# Altium schematic sheet Dual-MCU-control-board.SchDoc
size A1; SheetNumber: 1; SheetTotal: 1
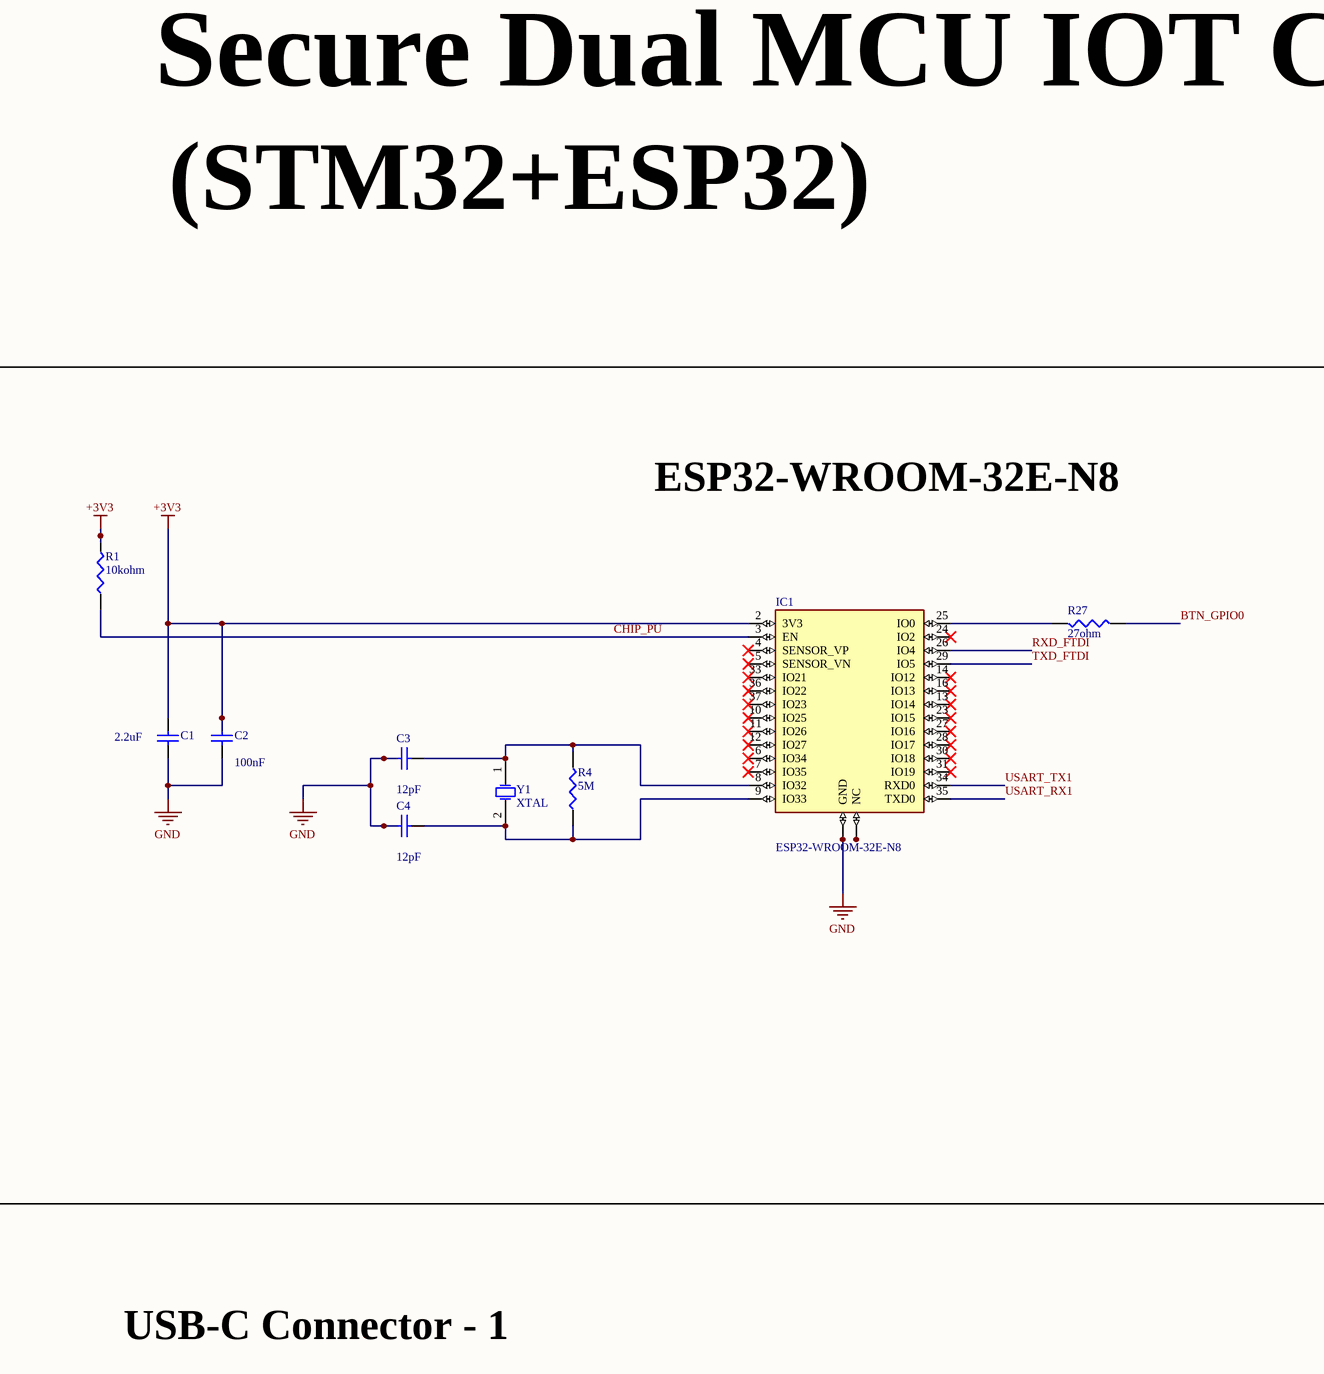
[diagram p0: Dual-MCU-control-board.SchDoc, top left]
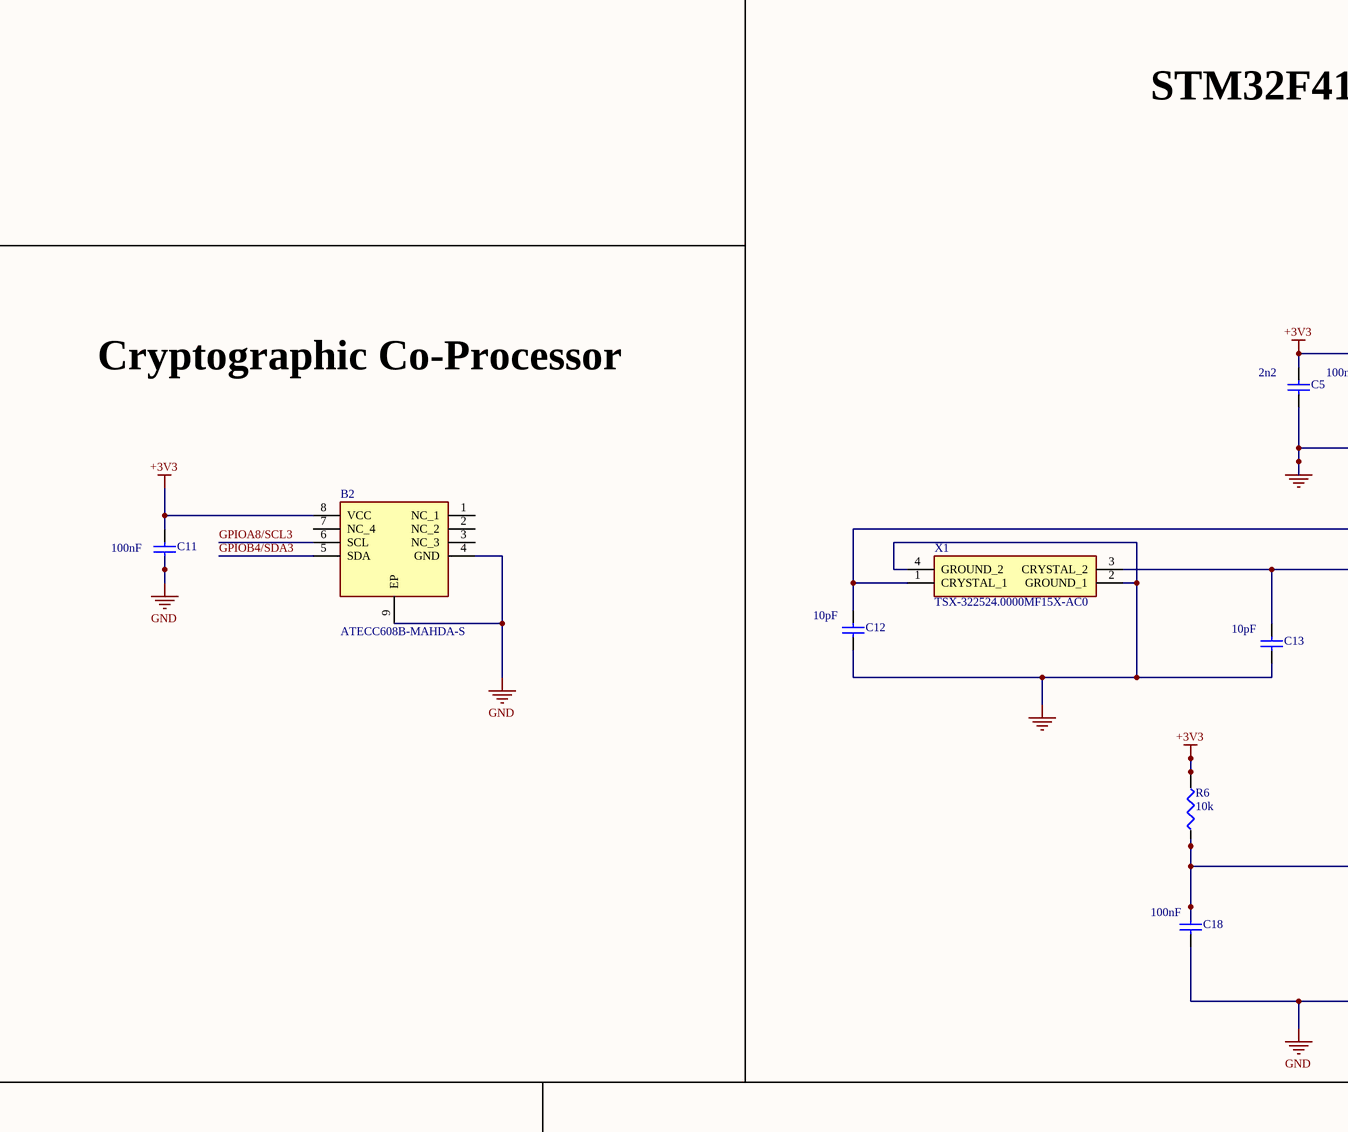
[diagram p1: Dual-MCU-control-board.SchDoc, top middle]
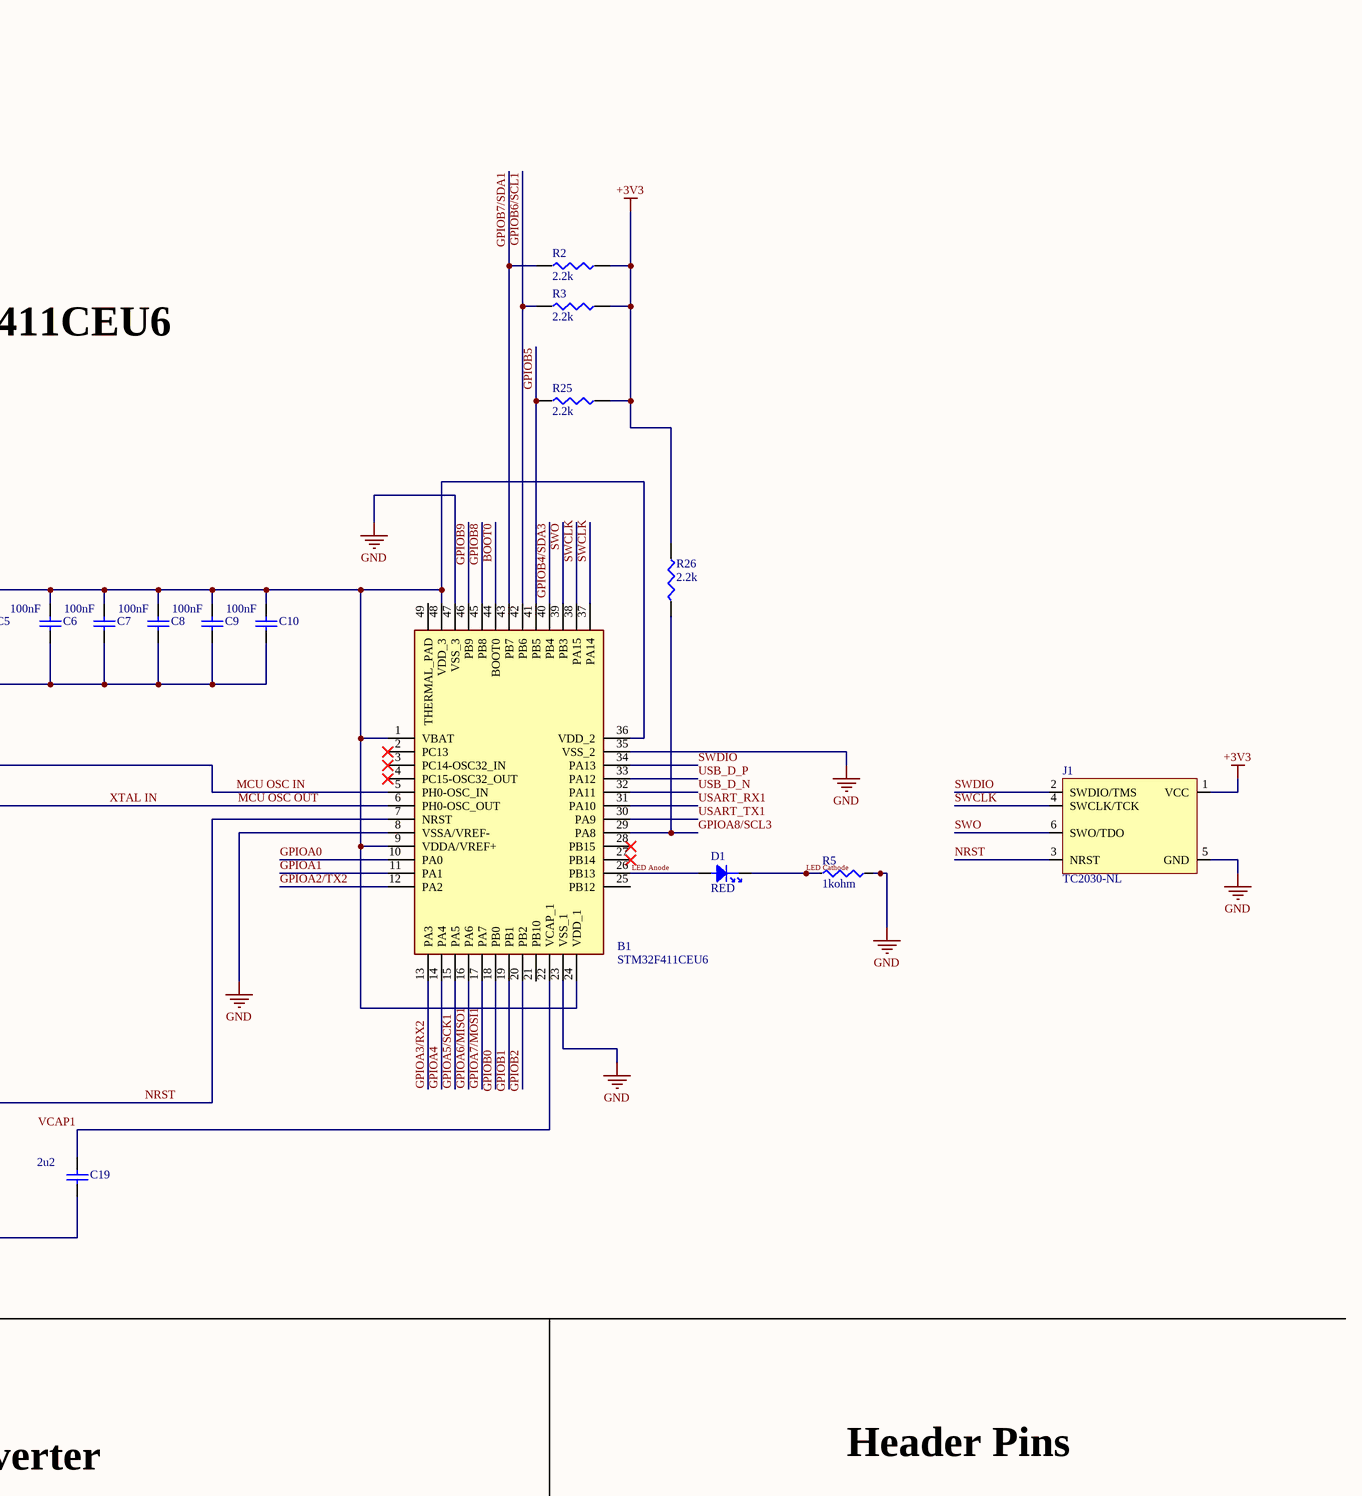
[diagram p2: Dual-MCU-control-board.SchDoc, top right]
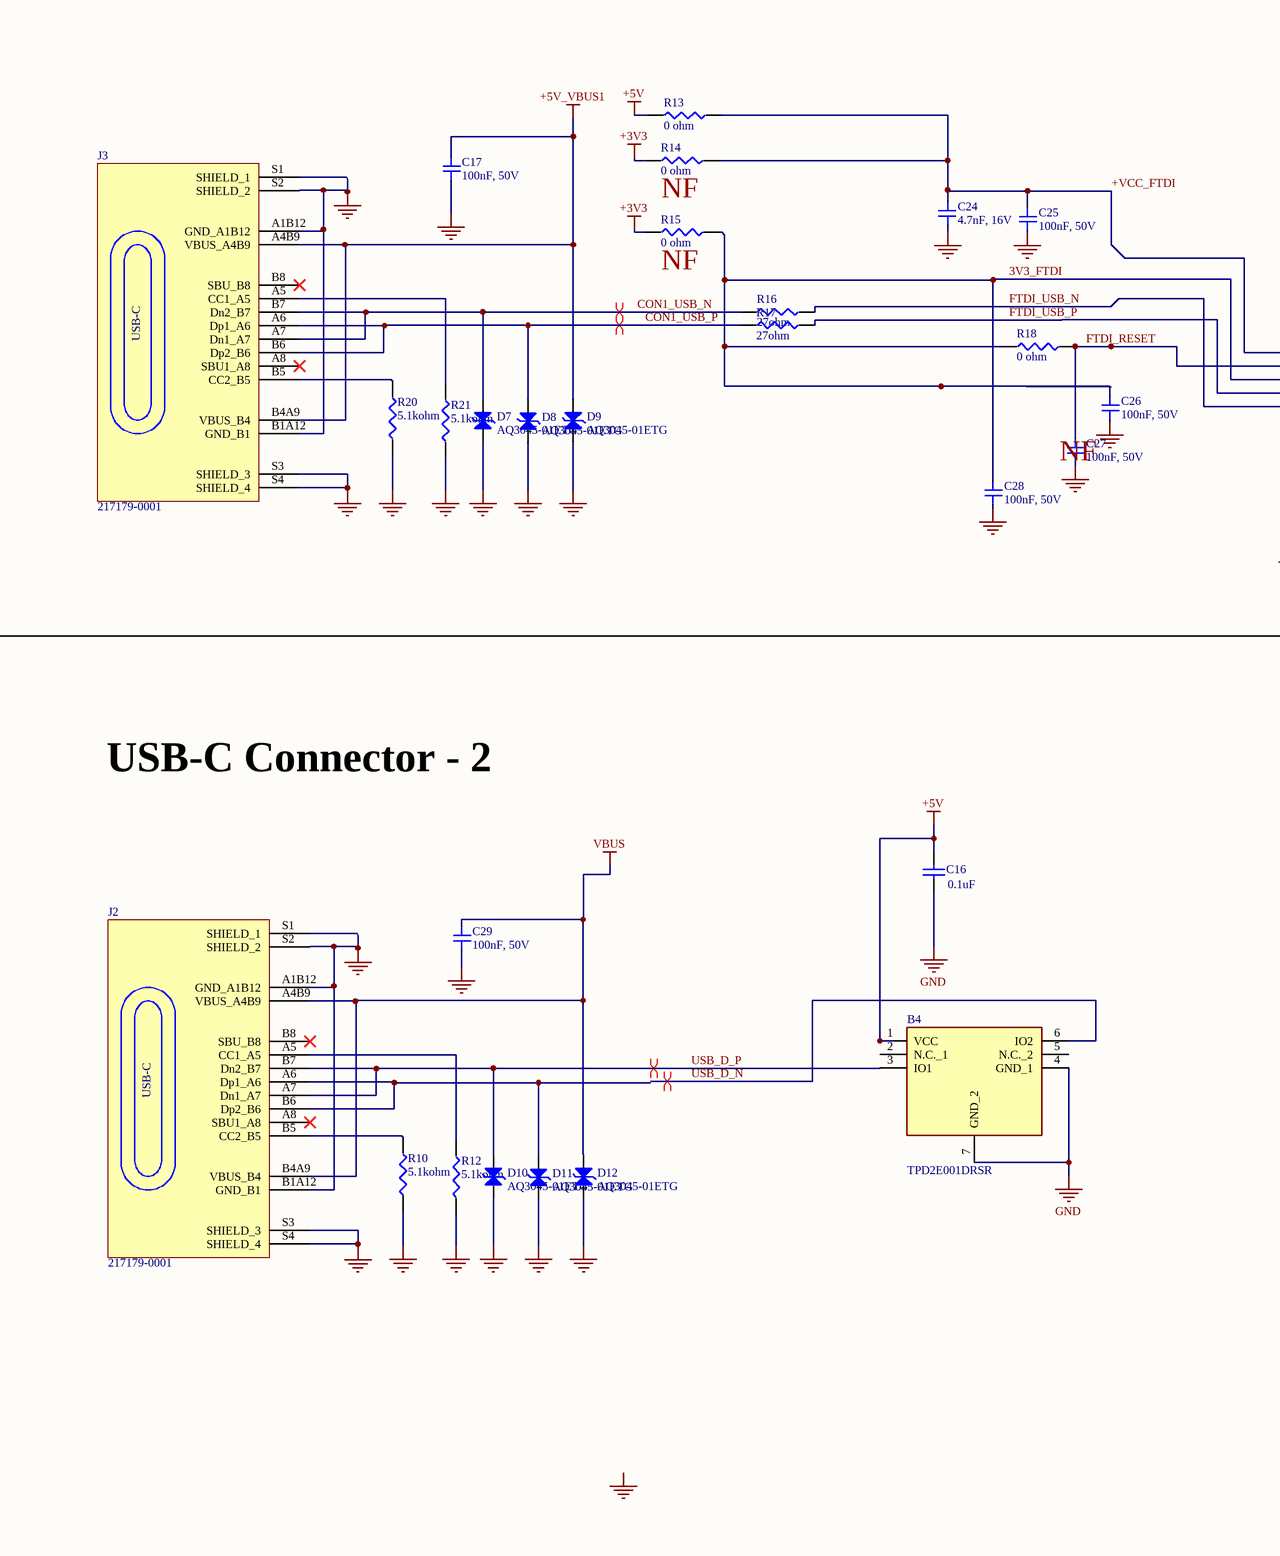
[diagram p3: Dual-MCU-control-board.SchDoc, bottom left]
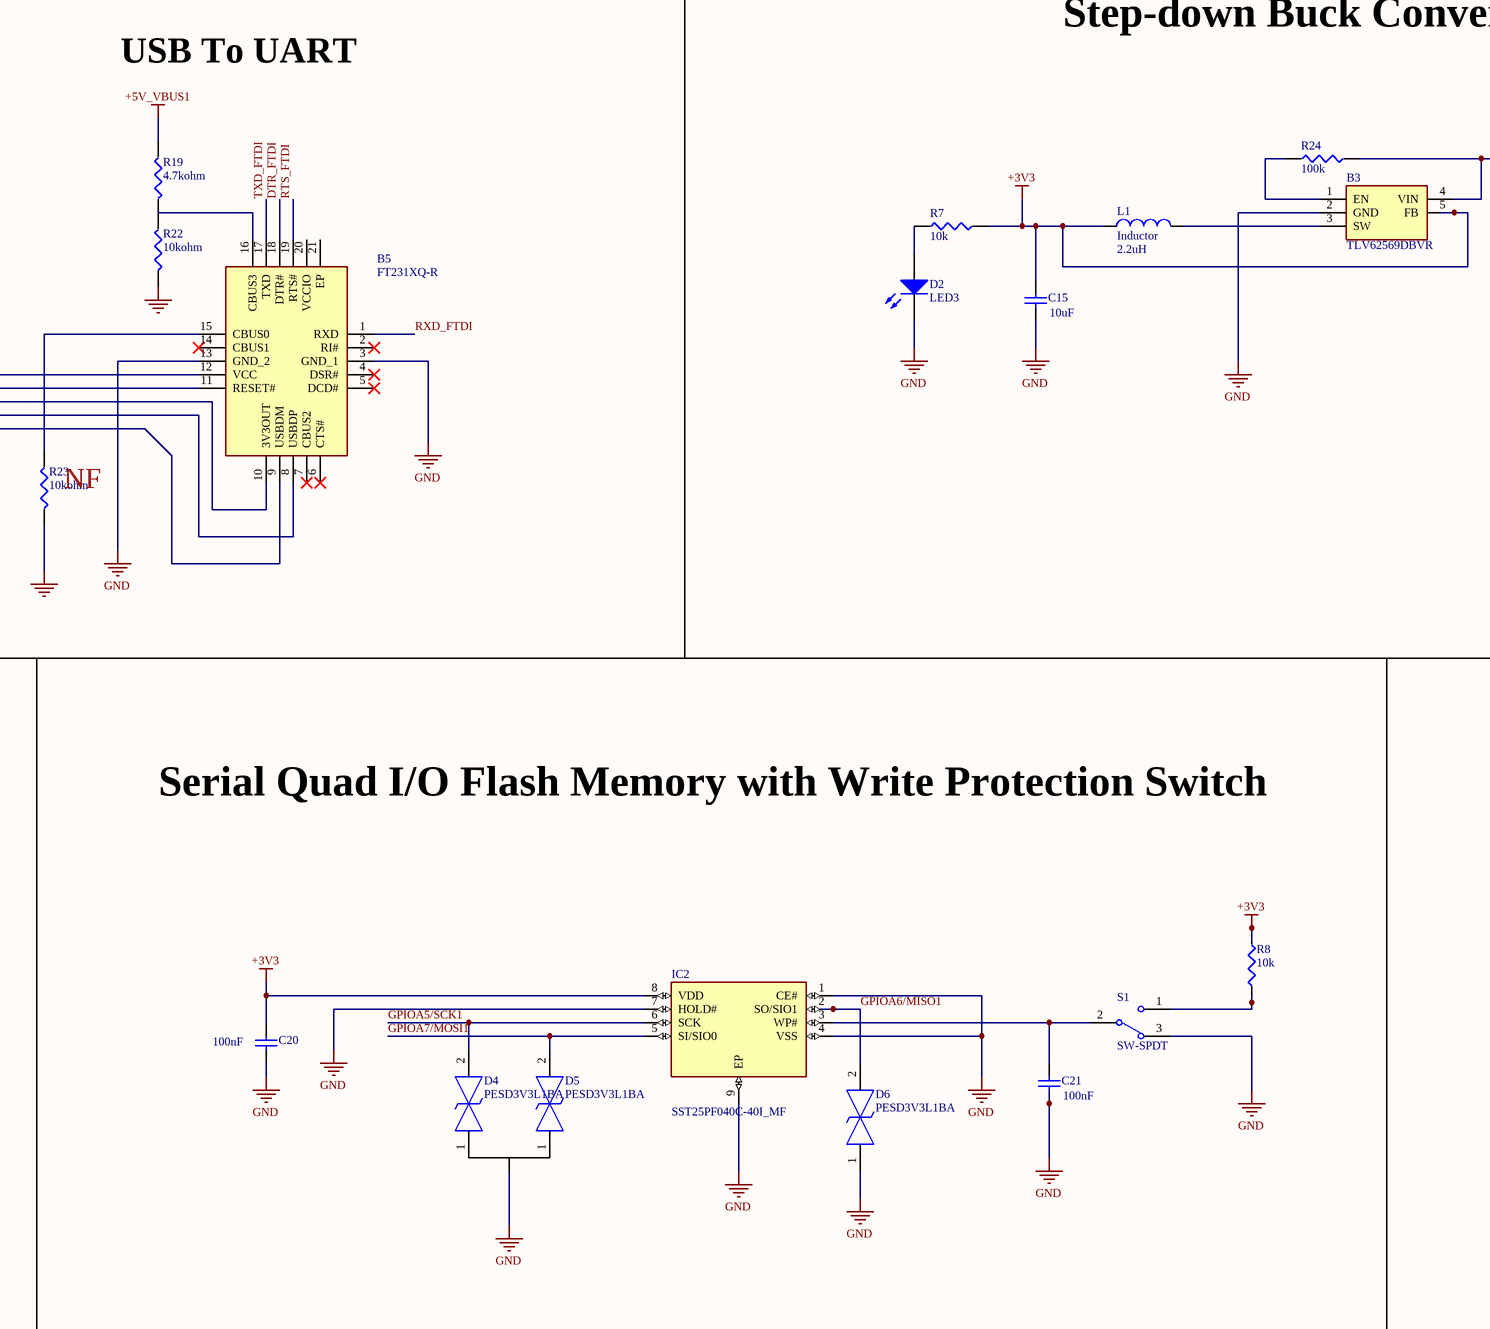
[diagram p4: Dual-MCU-control-board.SchDoc, bottom middle]
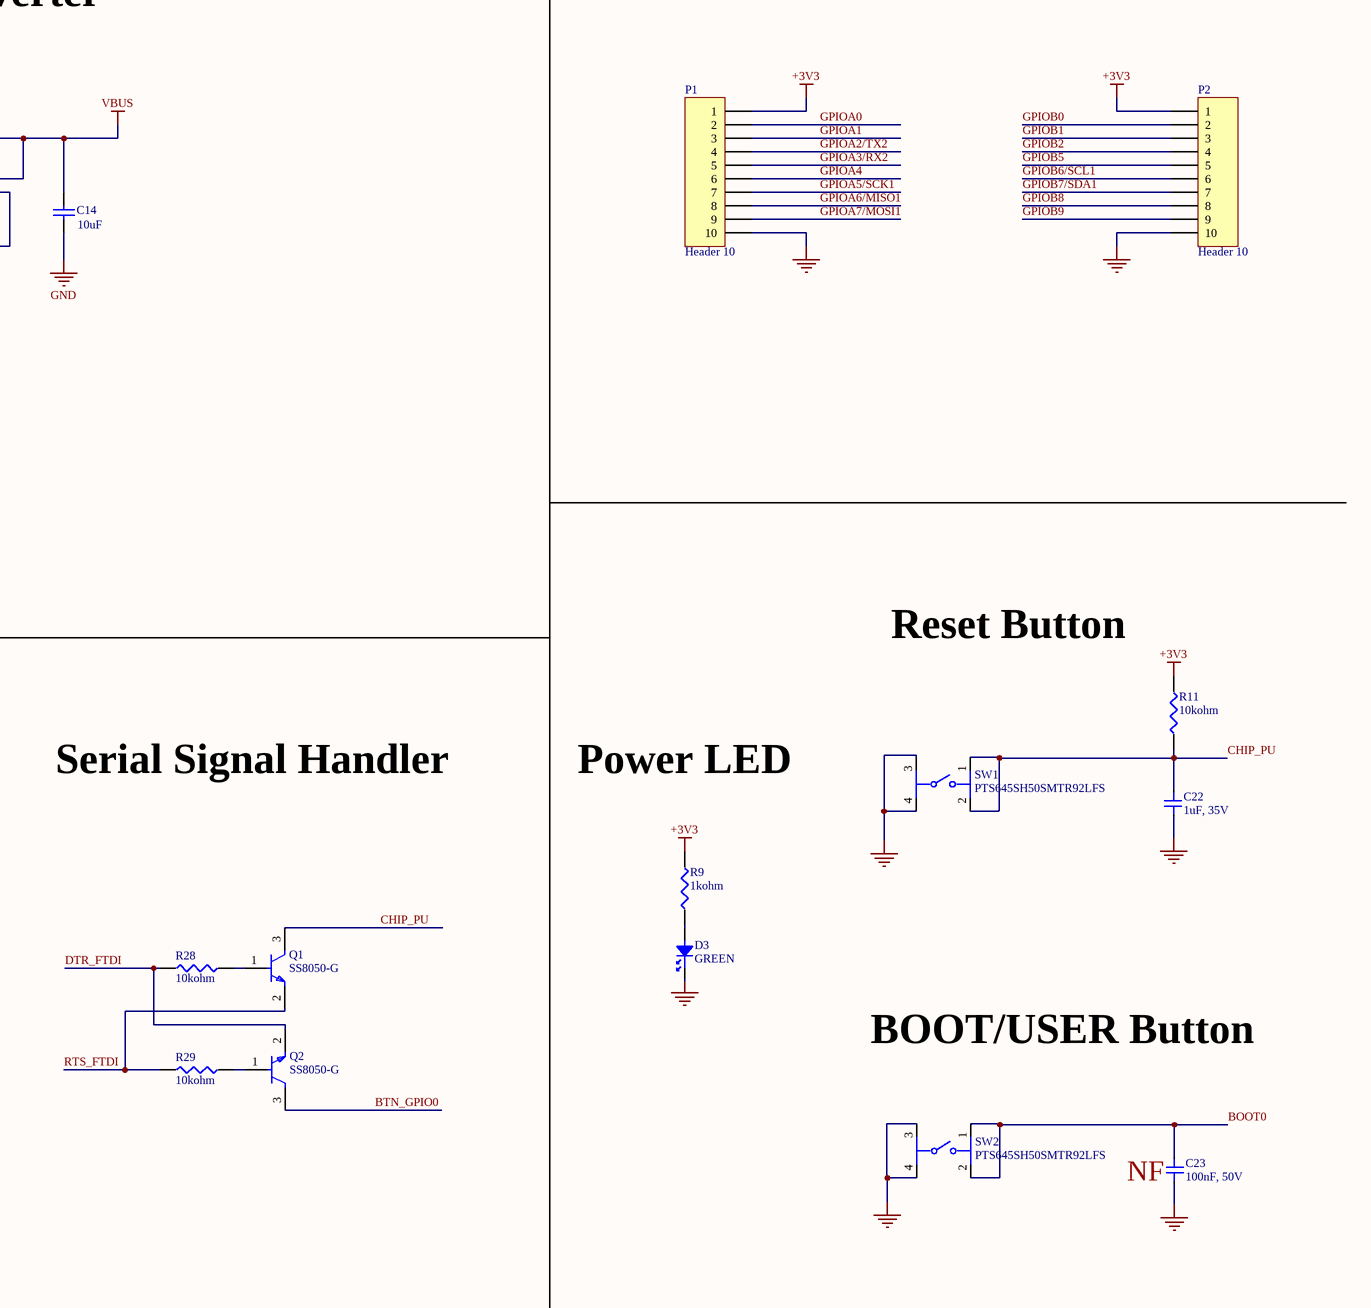
[diagram p5: Dual-MCU-control-board.SchDoc, bottom right]

## Parts
B1  STM32F411CEU6  [QFN50P700X700X60-49N-D]
B2  ATECC608B-MAHDA-S  [SON50P300X200X60-9N]
B3  TLV62569DBVR  [SOT95P280X145-5N]
B4  TPD2E001DRSR  [SON95P300X300X80-7N-D]
B5  FT231XQ-R  [QFN50P400X400X80-21N]
C1  value 2.2uF  [C1206]  (hidden comment: Cap Semi)
C2  value 100nF  [C1206]  (hidden comment: Cap Semi)
C3  value 12pF  [C1206]  (hidden comment: Cap Semi)
C4  value 12pF  [C1206]  (hidden comment: Cap Semi)
C5  value 2n2  [C1206]  (hidden comment: Cap Semi)
C6  value 100nF  [C1206]  (hidden comment: Cap Semi)
C7  value 100nF  [C1206]  (hidden comment: Cap Semi)
C8  value 100nF  [C1206]  (hidden comment: Cap Semi)
C9  value 100nF  [C1206]  (hidden comment: Cap Semi)
C10  value 100nF  [C1206]  (hidden comment: Cap Semi)
C11  value 100nF  [C1206]  (hidden comment: Cap Semi)
C12  value 10pF  [C1206]  (hidden comment: Cap Semi)
C13  value 10pF  [C1206]  (hidden comment: Cap Semi)
C14  value 10uF  [C1206]  (hidden comment: Cap Semi)
C15  value 10uF  [C1206]  (hidden comment: Cap Semi)
C16  value 0.1uF  [C1206]  (hidden comment: Cap Semi)
C17  100nF, 50V  [CAPC1005X55N]
C18  value 100nF  [C1206]  (hidden comment: Cap Semi)
C19  value 2u2  [C1206]  (hidden comment: Cap Semi)
C20  value 100nF  [C1206]  (hidden comment: Cap Semi)
C21  value 100nF  [C1206]  (hidden comment: Cap Semi)
C22  1uF, 35V  [CAPC1005X55N]
C23  100nF, 50V  [CAPC1005X55N]
C24  4.7nF, 16V  [CAPC1005X55N]
C25  100nF, 50V  [CAPC1005X55N]
C26  100nF, 50V  [CAPC1005X55N]
C27  100nF, 50V  [CAPC1005X55N]
C28  100nF, 50V  [CAPC1005X55N]
C29  100nF, 50V  [CAPC1005X55N]
D1  RED  [LEDC1005X35N]
D2  LED3  [3.5X2.8X1.9]
D3  GREEN  [LEDC1005X35N]
D4  PESD3V3L1BA  [SOD2512X110N]
D5  PESD3V3L1BA  [SOD2512X110N]
D6  PESD3V3L1BA  [SOD2512X110N]
D7  AQ3045-01ETG  [SOD882]
D8  AQ3045-01ETG  [SOD882]
D9  AQ3045-01ETG  [SOD882]
D10  AQ3045-01ETG  [SOD882]
D11  AQ3045-01ETG  [SOD882]
D12  AQ3045-01ETG  [SOD882]
IC1  ESP32-WROOM-32E-N8  [ESP32WROOM32EN8]
IC2  SST25PF040C-40I_MF  [SON127P600X500X80-9N]
J1  TC2030-NL  [TC2030-NL-FP]  (no BOM)
J2  217179-0001  [FP-2171790001-MFG]
J3  217179-0001  [FP-2171790001-MFG]
L1  Inductor  value 2.2uH  [0402-A]
P1  Header 10  [HDR1X10]
P2  Header 10  [HDR1X10]
Q1  SS8050-G  [FP-SS8050-G-IPC_B]
Q2  SS8050-G  [FP-SS8050-G-IPC_B]
R1  10kohm  [RESC1005X37N]
R2  2.2k  [RESC1005X37N]
R3  2.2k  [RESC1005X37N]
R4  5M  [RESC1005X37N]
R5  1kohm  [RESC1005X37N]
R6  10k  [RESC1005X37N]
R7  10k  [RESC1005X37N]
R8  10k  [RESC1005X37N]
R9  1kohm  [RESC1005X37N]
R10  5.1kohm  [RESC1005X37N]
R11  10kohm  [RESC1005X37N]
R12  5.1kohm  [RESC1005X37N]
R13  0 ohm  [RESC1005X37N]
R14  0 ohm  [RESC1005X37N]
R15  0 ohm  [RESC1005X37N]
R16  27ohm  [RESC1005X37N]
R17  27ohm  [RESC1005X37N]
R18  0 ohm  [RESC1005X37N]
R19  4.7kohm  [RESC1005X37N]
R20  5.1kohm  [RESC1005X37N]
R21  5.1kohm  [RESC1005X37N]
R22  10kohm  [RESC1005X37N]
R23  10kohm  [RESC1005X37N]
R24  100k  [RESC1005X37N]
R25  2.2k  [RESC1005X37N]
R26  2.2k  [RESC1005X37N]
R27  27ohm  [RESC1005X37N]
R28  10kohm  [RESC1005X37N]
R29  10kohm  [RESC1005X37N]
S1  SW-SPDT  [TL36WW15050]
SW1  PTS645SH50SMTR92LFS  [FP-PTS645SH50SMTR92LFS-MFG]
SW2  PTS645SH50SMTR92LFS  [FP-PTS645SH50SMTR92LFS-MFG]
X1  TSX-322524.0000MF15X-AC0  [TSX3225240000MF15XAC0]
Y1  XTAL  [R38]

## Nets
+3V3: B1.1(VBAT) B1.9(VDDA/VREF+) B1.24(VDD_1) B1.36(VDD_2) B1.48(VDD_3) B2.8(VCC) B3.5(FB) C1.2 C2.2 C5.2 C6.2 C7.2 C8.2 C9.2 C10.2 C11.2 C15.2 C20.2 IC1.2(3V3) IC2.8(VDD) J1.1(VCC) L1.1 P1.1 P2.1 R1.2 R2.1 R3.1 R6.2 R7.1 R8.2 R9.2 R11.2 R14.1 R15.1 R25.1 R26.1
+5V: B4.1(VCC) C16.2 R13.1
+5V_VBUS1: C17.1 D9.2 J3.A4B9(VBUS_A4B9) J3.B4A9(VBUS_B4) R19.2
GND: B1.8(VSSA/VREF-) B1.23(VSS_1) B1.35(VSS_2) B1.47(VSS_3) B2.4(GND) B2.9(EP) B3.2(GND) B4.4(GND_1) B4.7(GND_2) B5.3(GND_1) B5.13(GND_2) C1.1 C2.1 C3.2 C4.2 C5.1 C6.1 C7.1 C8.1 C9.1 C10.1 C11.1 C12.1 C13.1 C14.1 C15.1 C16.1 C17.2 C18.1 C19.1 C20.1 C21.1 C22.1 C23.2 C24.1 C25.2 C26.2 C27.2 C28.2 C29.2 D2.2(K) D3.1 D6.1 D7.1 D8.1 D9.1 D10.1 D11.1 D12.1 IC1.1(GND) IC1.15(GND) IC1.38(GND) IC1.39(GND) IC1.40(GND) IC1.41(GND) IC1.42(GND) IC1.43(GND) IC1.44(GND) IC1.45(GND) IC1.46(GND) IC1.47(GND) IC2.1(CE#) IC2.4(VSS) IC2.7(HOLD#) IC2.9(EP) J1.5(GND) J2.A1B12(GND_A1B12) J2.B1A12(GND_B1) J2.S1(SHIELD_1) J2.S2(SHIELD_2) J2.S3(SHIELD_3) J2.S4(SHIELD_4) J3.A1B12(GND_A1B12) J3.B1A12(GND_B1) J3.S1(SHIELD_1) J3.S2(SHIELD_2) J3.S3(SHIELD_3) J3.S4(SHIELD_4) P1.10 P2.10 R5.1 R10.2 R12.2 R20.2 R21.2 R22.1 R23.2 S1.3 SW1.3 SW1.4 SW2.3 SW2.4 X1.2(GROUND_1) X1.4(GROUND_2)
VBUS: B3.4(VIN) C14.2 C29.1 D12.2 J2.A4B9(VBUS_A4B9) J2.B4A9(VBUS_B4) R24.2
3V3_FTDI: B5.10(3V3OUT) C26.1 C28.1 R15.2 R18.1
+VCC_FTDI: B5.12(VCC) C24.2 C25.1 R13.2 R14.2
BOOT0: B1.44(BOOT0) C23.1 SW2.1 SW2.2
BTN_GPIO0: Q2.3(C) R27.1
CHIP_PU: C22.2 IC1.3(EN) Q1.3(C) R1.1 R11.1 SW1.1 SW1.2
CON1_USB_N: D7.2 J3.A7(Dn1_A7) J3.B7(Dn2_B7) R16.1
CON1_USB_P: D8.2 J3.A6(Dp1_A6) J3.B6(Dp2_B6) R17.1
DTR_FTDI: B5.18(DTR#) Q2.2(E) R28.1
FTDI_RESET: B5.11(RESET#) C27.1 R18.2
FTDI_USB_N: B5.9(USBDM) R16.2
FTDI_USB_P: B5.8(USBDP) R17.2
GPIOA0: B1.10(PA0) P1.2
GPIOA1: B1.11(PA1) P1.3
GPIOA2/TX2: B1.12(PA2) P1.4
GPIOA3/RX2: B1.13(PA3) P1.5
GPIOA4: B1.14(PA4) P1.6
GPIOA5/SCK1: B1.15(PA5) D4.2 IC2.6(SCK) P1.7
GPIOA6/MISO1: B1.16(PA6) D6.2 IC2.2(SO/SIO1) P1.8
GPIOA7/MOSI1: B1.17(PA7) D5.2 IC2.5(SI/SIO0) P1.9
GPIOA8/SCL3: B1.29(PA8) B2.6(SCL) R26.2
GPIOB0: B1.18(PB0) P2.2
GPIOB1: B1.19(PB1) P2.3
GPIOB2: B1.20(PB2) P2.4
GPIOB4/SDA3: B1.40(PB4) B2.5(SDA)
GPIOB5: B1.41(PB5) P2.5 R25.2
GPIOB6/SCL1: B1.42(PB6) P2.6 R3.2
GPIOB7/SDA1: B1.43(PB7) P2.7 R2.2
GPIOB8: B1.45(PB8) P2.8
GPIOB9: B1.46(PB9) P2.9
LED Anode: B1.26(PB13) D1.2
LED Cathode: D1.1 R5.2
MCU OSC IN: B1.5(PH0-OSC_IN) C12.2 X1.1(CRYSTAL_1)
MCU OSC OUT: B1.6(PH0-OSC_OUT) C13.2 X1.3(CRYSTAL_2)  [also labelled XTAL IN]
NRST: B1.7(NRST) C18.2 J1.3(NRST) R6.1
RTS_FTDI: B5.19(RTS#) Q1.2(E) R29.1
RXD_FTDI: B5.1(RXD) IC1.26(IO4)
SWCLK: B1.37(PA14) B1.38(PA15) J1.4(SWCLK/TCK)
SWDIO: B1.34(PA13) J1.2(SWDIO/TMS)
SWO: B1.39(PB3) J1.6(SWO/TDO)
TXD_FTDI: B5.17(TXD) IC1.29(IO5)
USART_RX1: B1.31(PA10) IC1.35(TXD0)
USART_TX1: B1.30(PA9) IC1.34(RXD0)
USB_D_N: B1.32(PA11) B4.6(IO2)
USB_D_P: B1.33(PA12) B4.3(IO1) D10.2 J2.A7(Dn1_A7) J2.B7(Dn2_B7)
VCAP1: B1.22(VCAP_1) C19.2
NetB3_1: B3.1(EN) R24.1
NetB3_3: B3.3(SW) L1.2
NetB5_15: B5.15(CBUS0) R23.1
NetB5_16: B5.16(CBUS3) R22.2
NetC3_1: C3.1 IC1.8(IO32) R4.2 Y1.1(OSC1)
NetC4_1: C4.1 IC1.9(IO33) R4.1 Y1.2(OSC2)
NetC21_2: C21.2 IC2.3(WP#) S1.2
NetD2_1: D2.1(A) R7.2
NetD3_2: D3.2 R9.1
NetD11_2: D11.2 J2.A6(Dp1_A6) J2.B6(Dp2_B6)
NetIC1_17: IC1.17(NC) IC1.18(NC) IC1.19(NC) IC1.20(NC) IC1.21(NC) IC1.22(NC) IC1.32(NC)
NetIC1_25: IC1.25(IO0) R27.2
NetJ2_A5: J2.A5(CC1_A5) R12.1
NetJ2_B5: J2.B5(CC2_B5) R10.1
NetJ3_A5: J3.A5(CC1_A5) R21.1
NetJ3_B5: J3.B5(CC2_B5) R20.1
NetQ1_1: Q1.1(B) R28.2
NetQ2_1: Q2.1(B) R29.2
NetR8_1: R8.1 S1.1

Not connected (* = marked no-connect by the designer): B1 2(PC13)* 3(PC14-OSC32_IN)* 4(PC15-OSC32_OUT)* 21(PB10) 25(PB12) 27(PB14)* 28(PB15)* 49(THERMAL_PAD); B2 1(NC_1) 2(NC_2) 3(NC_3) 7(NC_4); B4 2(N.C._1) 5(N.C._2); B5 2(RI#)* 4(DSR#)* 5(DCD#)* 6(CTS#)* 7(CBUS2)* 14(CBUS1)* 20(VCCIO) 21(EP); D4 1; D5 1; IC1 4(SENSOR_VP)* 5(SENSOR_VN)* 6(IO34)* 7(IO35)* 10(IO25)* 11(IO26)* 12(IO27)* 13(IO14)* 14(IO12)* 16(IO13)* 23(IO15)* 24(IO2)* 27(IO16)* 28(IO17)* 30(IO18)* 31(IO19)* 33(IO21)* 36(IO22)* 37(IO23)*; J2 A8(SBU1_A8)* B8(SBU_B8)*; J3 A8(SBU1_A8)* B8(SBU_B8)*; R19 1

## Layout directives
differential pair; differential pair class DIFF90: CON1_USB_N, CON1_USB_P, USB_D_N, USB_D_P

## Notes on the sheet
- Secure Dual MCU IOT Control Board
- (STM32+ESP32)
- STM32F411CEU6
- ESP32-WROOM-32E-N8
- Cryptographic Co-Processor
- USB-C Connector - 1
- USB To UART
- Step-down Buck Converter
- Header Pins
- (near R14) NF
- (near R15) NF
- (near C27) NF
- (near R23) NF
- Reset Button
- USB-C Connector - 2
- Serial Quad I/O Flash Memory with Write Protection Switch
- Serial Signal Handler
- Power LED
- BOOT/USER Button
- (near C23) NF
- Labels drawn without touching a wire or pin: GND
- (in symbol 217179-0001) USB-C

## Library data of the parts
B1 = STM32F411CEU6: 32-Bit MCU 512K Flash 100MHz UFQFPN48 STMicroelectronics STM32F411CEU6, 32bit ARM Cortex M4 MCU, 100MHz, 512 kB Flash, 48-Pin UFQFPN; Geometry.Height: 0.6mm; Manufacturer_Name: STMicroelectronics; Manufacturer_Part_Number: STM32F411CEU6; Mouser Part Number: 511-STM32F411CEU6; Mouser Price/Stock: https://www.mouser.co.uk/ProductDetail/STMicroelectronics/STM32F411CEU6?qs=pjMTYa9MTGV3ou31YBFa3g%3D%3D; Arrow Part Number: STM32F411CEU6; Arrow Price/Stock: https://www.arrow.com/en/products/stm32f411ceu6/stmicroelectronics.html?utm_currency=USD&region=nac; Datasheet Link: https://www.st.com/resource/en/datasheet/stm32f411ce.pdf
B2 = ATECC608B-MAHDA-S: Security ICs / Authentication ICs ECC/ECDH, I2C, small 3K reel UDFN; Manufacturer_Name: Microchip; Geometry.Height: 0.6mm; Manufacturer_Part_Number: ATECC608B-MAHDA-S; Mouser Part Number: 579-TECC608B-MAHDA-S; Mouser Price/Stock: https://www.mouser.co.uk/ProductDetail/Microchip-Technology/ATECC608B-MAHDA-S?qs=sPbYRqrBIVnKfPKcuUlUgg%3D%3D; Arrow Part Number: ATECC608B-MAHDA-S; Arrow Price/Stock: https://www.arrow.com/en/products/atecc608b-mahda-s/microchip-technology?region=nac; Datasheet Link: https://4donline.ihs.com/images/VipMasterIC/IC/MCHP/MCHP-S-A0013079379/MCHP-S-A0013869273-1.pdf?hkey=6D3A4C79FDBF58556ACFDE234799DDF0
B3 = TLV62569DBVR: 2.5V-5.5V input, 2-A high efficiency step-down buck converter in SOT23 and SOT563 package; Manufacturer_Name: Texas Instruments; Geometry.Height: 1.45mm; Manufacturer_Part_Number: TLV62569DBVR; Mouser Part Number: 595-TLV62569DBVR; Mouser Price/Stock: https://www.mouser.co.uk/ProductDetail/Texas-Instruments/TLV62569DBVR?qs=0C8XhJW8e4oaylc%252BzBrCmA%3D%3D; Arrow Part Number: TLV62569DBVR; Arrow Price/Stock: https://www.arrow.com/en/products/tlv62569dbvr/texas-instruments.html?utm_currency=USD&region=nac; Datasheet Link: http://www.ti.com/lit/gpn/tlv62569
B4 = TPD2E001DRSR: TPD2E001 LOW-CAPACITANCE 2-CHANNEL +/-15-kV ESD-PROTECTION ARRAY FOR HIGH-SPEED DATA INTERFACES; Manufacturer_Name: Texas Instruments; Geometry.Height: 0.8mm; Manufacturer_Part_Number: TPD2E001DRSR; Mouser Part Number: 595-TPD2E001DRSR; Mouser Price/Stock: https://www.mouser.co.uk/ProductDetail/Texas-Instruments/TPD2E001DRSR?qs=QyYHynRG50pgu5t2LiIdgQ%3D%3D; Arrow Part Number: TPD2E001DRSR; Arrow Price/Stock: https://www.arrow.com/en/products/tpd2e001drsr/texas-instruments?region=nac; Datasheet Link: http://www.ti.com/lit/gpn/tpd2e001
B5 = FT231XQ-R: FTDI Chip FT231XQ-R, USB Transceiver; Geometry.Height: 0.8mm; Manufacturer_Name: FTDI Chip; Manufacturer_Part_Number: FT231XQ-R; Mouser Part Number: 895-FT231XQ-R; Mouser Price/Stock: https://www.mouser.co.uk/ProductDetail/FTDI/FT231XQ-R?qs=Gp1Yz1mis3VkAf3iW%252BkumQ%3D%3D; Arrow Part Number: FT231XQ-R; Arrow Price/Stock: https://www.arrow.com/en/products/ft231xq-r/ftdi-chip?region=nac; Datasheet Link: http://www.ftdichip.com/Support/Documents/DataSheets/ICs/DS_FT231X.pdf
C1-C16 C18-C21 = Cap Semi: Capacitor (Semiconductor SIM Model); Published: 8-Jun-2000; LatestRevisionDate: 29-May-2009; LatestRevisionNote: IPC-7351 Footprint Added.; PackageReference: C1206; Publisher: Altium Limited; PackageDescription: Chip Capacitor
C17 C23 C25-C29 = CL05B104KB54PNC: CAP CER 0.1UF 50V X7R 0402; Manufacturer: Samsung; Dielectric Material: Ceramic; Supplier: Digikey; Supplier Part Number: 1276-CL05B104KB54PNCCT-ND; Manufacturer Part Number: CL05B104KB54PNC; RoHS: Yes; Category: Ceramic Capacitors; Stock: 1395958; Pricing: 1=0.1, 10=0.03, 100=0.018, 1000=0.01195, 2500=0.01037, 5000=0.00939 (USD); Pins: 2; Capacitor Type: Ceramic; RoHS Compliant: Yes; Reach SVHC Compliant: Yes; ComponentLink1URL: https://datasheet.ciiva.com:443/pdfs/VipMasterIC/IC/SEMS/SEMS-S-A0006318249/SEMS-S-A0006320959-1.pdf?src-supplier=IHS+Markit; ComponentLink1Description: https://datasheet.ciiva.com:443/pdfs/VipMasterIC/IC/SEMS/SEMS-S-A0006318249/SEMS-S-A0006320959-1.pdf?src-supplier=IHS+Markit; ComponentLink2URL: https://datasheet.octopart.com/CL05B104KB54PNC-Samsung-datasheet-8326407.pdf?src-supplier=TME; ComponentLink2Description: https://datasheet.octopart.com/CL05B104KB54PNC-Samsung-datasheet-8326407.pdf?src-supplier=TME; LCSC Part Number: C307331
C22 = CL05A105KL5NRNC: CAP CER 1UF 35V X5R 0402; Manufacturer: Samsung; Dielectric Material: Ceramic; Multilayer: Yes; Tolerance  (fill in as +-): 10%; Supplier: Digikey; Supplier Part Number: 1276-6796-1-ND; Manufacturer Part Number: CL05A105KL5NRNC; RoHS: Yes; Category: Ceramic Capacitors; Stock: 198003; Pricing: 1=0.27, 10=0.161, 100=0.1064, 1000=0.07632, 2500=0.06828, 5000=0.06324 (USD); Mounting Technology: Surface Mount; Pins: 2; Package Shape: Rectangular; Case/Package: 0402; Terminal Finish: Nickel; Min Operating Temperature: -55°C; Max Operating Temperature: 85°C; JESD-609 Code: e3; Value: 1uF; Capacitor Type: Ceramic; Packaging: Tape and Reel; Tolerance (fill in as +-): 10%; Rated DC Voltage (URdc): 35V; Temperature Characteristics Code: X5R; Termination: Wraparound; Reach SVHC Compliant: Yes; RoHS Compliant: Yes; ComponentLink1URL: https://datasheet.ciiva.com:443/pdfs/VipMasterIC/IC/SEMS/SEMS-S-A0008384515/SEMS-S-A0008872905-1.pdf?src-supplier=IHS+Markit; ComponentLink1Description: https://datasheet.ciiva.com:443/pdfs/VipMasterIC/IC/SEMS/SEMS-S-A0008384515/SEMS-S-A0008872905-1.pdf?src-supplier=IHS+Markit; ComponentLink2URL: http://www.samsungsem.com/kr/support/product-search/mlcc/CL05A105KL5NRNC.jsp?src-supplier=Digikey; ComponentLink2Description: http://www.samsungsem.com/kr/support/product-search/mlcc/CL05A105KL5NRNC.jsp?src-supplier=Digikey; LCSC Part Number: C307413
C24 = C0402C472K4RECAUTO: CAP CER 0402 4.7NF 16V X7R 10%; Manufacturer: KEMET; Supplier: Digikey; Supplier Part Number: 399-17875-1-ND; Manufacturer Part Number: C0402C472K4RECAUTO; RoHS: Yes; Category: Ceramic Capacitors; Stock: 21747; Pricing: 1=0.12, 10=0.065, 100=0.0412, 1000=0.02838, 2500=0.025, 5000=0.02288 (USD); Mounting Technology: Surface Mount; Case/Package: 0402; Min Operating Temperature: -55°C; Max Operating Temperature: 125°C; Packaging: Cut Tape; Value: 4.7nF; Tolerance: 10%; Voltage Rating: 16V; Series: C; Dielectric: X7R; Voltage Rating (DC): 16V; Ratings: AEC-Q200; RoHS Compliant: Yes; ComponentLink1URL: https://api.kemet.com/component-edge/download/datasheet/C0402C472K4RECAUTO.pdf?src-supplier=Digikey; ComponentLink1Description: https://api.kemet.com/component-edge/download/datasheet/C0402C472K4RECAUTO.pdf?src-supplier=Digikey; ComponentLink2URL: https://datasheet.octopart.com/C0402C472K4RECAUTO-KEMET-datasheet-149521746.pdf?src-supplier=Farnell; ComponentLink2Description: https://datasheet.octopart.com/C0402C472K4RECAUTO-KEMET-datasheet-149521746.pdf?src-supplier=Farnell; ComponentLink3URL: https://datasheet.octopart.com/C0402C472K4RECAUTO-KEMET-datasheet-176334298.pdf?src-supplier=Newark; ComponentLink3Description: https://datasheet.octopart.com/C0402C472K4RECAUTO-KEMET-datasheet-176334298.pdf?src-supplier=Newark; LCSC Part Number: C2176618
D1 = VLMS1500-GS08: Single Color LED, Super Red, 0.5mm; Manufacturer: Vishay; Shape: Rectangular; Forward Current: 30mA; Forward Voltage: 2.4V; Luminous Intensity-Nom: 54mcd; Channels: 1; Reverse Voltage-Max: 5V; Viewing Angle: 130°; Overall Height: 0.35mm; Supplier: Digikey; Supplier Part Number: VLMS1500-GS08CT-ND; Manufacturer Part Number: VLMS1500-GS08; RoHS: Yes; Category: LEDs; Stock: 69085; Pricing: 1=0.33, 10=0.189, 100=0.1166, 500=0.08838, 1000=0.07977 (USD); Mounting Technology: Surface Mount; Pins: 2; Color: Red; Color@wavelength: Red; Min Operating Temperature: -30°C; Max Operating Temperature: 85°C; Optoelectronic Device Type: SINGLE COLOR LED; Packaging: Tape and Reel; Size: 0.5mm; Terminal Pitch: 0.95mm; Reach SVHC Compliant: Yes; RoHS Compliant: Yes; ComponentLink1URL: https://datasheet.ciiva.com:443/pdfs/VipMasterIC/IC/VISH/VISH-S-A0003457490/VISH-S-A0003457490-1.pdf?src-supplier=IHS+Markit; ComponentLink1Description: https://datasheet.ciiva.com:443/pdfs/VipMasterIC/IC/VISH/VISH-S-A0003457490/VISH-S-A0003457490-1.pdf?src-supplier=IHS+Markit; ComponentLink2URL: https://datasheet.ciiva.com/13945/vlmo1500-13945367.pdf?src-supplier=Digikey; ComponentLink2Description: https://datasheet.ciiva.com/13945/vlmo1500-13945367.pdf?src-supplier=Digikey; ComponentLink3URL: https://datasheet.ciiva.com/13945/vlmo1500-13945368.pdf?src-supplier=Digikey; ComponentLink3Description: https://datasheet.ciiva.com/13945/vlmo1500-13945368.pdf?src-supplier=Digikey; ComponentLink4URL: https://datasheet.ciiva.com/13945/vlmo1500-13945369.pdf?src-supplier=Digikey; ComponentLink4Description: https://datasheet.ciiva.com/13945/vlmo1500-13945369.pdf?src-supplier=Digikey; LCSC Part Number: C511370
D2 = LED3: Typical BLUE SiC LED; Published: 8-Jun-2000; LatestRevisionDate: 17-Dec-2003; LatestRevisionNote: PCB Footprint replaced.; DatasheetVersion: 16-Apr-2002; PackageVersion: 16-Apr-2002; PackageReference: 3.5X2.8X1.9; Publisher: Altium Limited; PackageDescription: SM LED; 2 C-Bend Leads; Body 3.5 x 2.8 x 1.9 mm, inc leads (LxWxH typ)
D3 = VLMG1500-GS08: Single Color LED, Yellow Green, 0.5mm; Manufacturer: Vishay; Color: Green,Yellow; Shape: Rectangular; Forward Current: 30mA; Forward Voltage: 2.4V; Luminous Intensity-Nom: 90mcd; Channels: 1; Reverse Voltage-Max: 5V; Viewing Angle: 130°; Overall Height: 0.35mm; Supplier: Digikey; Supplier Part Number: VLMG1500-GS08DKR-ND; Manufacturer Part Number: VLMG1500-GS08; RoHS: Yes; Category: LEDs; Stock: 48646; Pricing: 1=0.33, 10=0.189, 100=0.1166, 500=0.08838, 1000=0.07977 (USD); Mounting Technology: Surface Mount; Pins: 2; Color@wavelength: Green; Min Operating Temperature: -30°C; Max Operating Temperature: 85°C; Optoelectronic Device Type: SINGLE COLOR LED; Packaging: Tape and Reel; Size: 0.5mm; Terminal Pitch: 0.95mm; Reach SVHC Compliant: Yes; RoHS Compliant: Yes; ComponentLink1URL: https://datasheet.ciiva.com:443/pdfs/VipMasterIC/IC/VISH/VISH-S-A0003457490/VISH-S-A0003457490-1.pdf?src-supplier=IHS+Markit; ComponentLink1Description: https://datasheet.ciiva.com:443/pdfs/VipMasterIC/IC/VISH/VISH-S-A0003457490/VISH-S-A0003457490-1.pdf?src-supplier=IHS+Markit; ComponentLink2URL: https://datasheet.ciiva.com/12071/vlmo1500-244705-12071911.pdf?src-supplier=Mouser; ComponentLink2Description: https://datasheet.ciiva.com/12071/vlmo1500-244705-12071911.pdf?src-supplier=Mouser; ComponentLink3URL: https://datasheet.ciiva.com/13945/vlmo1500-13945360.pdf?src-supplier=Digikey; ComponentLink3Description: https://datasheet.ciiva.com/13945/vlmo1500-13945360.pdf?src-supplier=Digikey; ComponentLink4URL: https://datasheet.ciiva.com/30005/vlmo1500-30005134.pdf?src-supplier=Avnet; ComponentLink4Description: https://datasheet.ciiva.com/30005/vlmo1500-30005134.pdf?src-supplier=Avnet; ComponentLink5URL: https://datasheet.ciiva.com/13945/vlmo1500-13945358.pdf?src-supplier=Digikey; ComponentLink5Description: https://datasheet.ciiva.com/13945/vlmo1500-13945358.pdf?src-supplier=Digikey; ComponentLink6URL: https://datasheet.ciiva.com/13945/vlmo1500-13945359.pdf?src-supplier=Digikey; ComponentLink6Description: https://datasheet.ciiva.com/13945/vlmo1500-13945359.pdf?src-supplier=Digikey; LCSC Part Number: C511404
D4-D6 = PESD3V3L1BA: TVS Diode Bi-Directional PESD3V3L1BA 26V, 500W, UMD 2-Pin; Manufacturer_Name: Nexperia; Geometry.Height: 1.1mm; Manufacturer_Part_Number: PESD3V3L1BA; Mouser Part Number: N/A; Mouser Price/Stock: https://www.mouser.co.uk/ProductDetail/Nexperia/PESD3V3L1BA?qs=vHuUswq2%252BswBNSPO0jzUyg%3D%3D; Arrow Part Number: *; Arrow Price/Stock: *; Datasheet Link: https://datasheet.datasheetarchive.com/originals/distributors/Datasheets-26/DSA-502681.pdf
D7-D12 = AQ3045-01ETG: TVS DIODE 5.3VWM 12VC SOD882; Manufacturer: Littelfuse; Number of Bidirectional Channels: 1; Reverse Standoff Voltage: 5.3V; Min Breakdown Voltage: 6.8V; Peak Pulse Current: 3A; Peak Pulse Power: 40W; Power Line Protection: No; Diode Type: ZENER; Leakage Current: 100nA; Supplier: Digikey; Supplier Part Number: F9321CT-ND; Manufacturer Part Number: AQ3045-01ETG; RoHS: Yes; Category: TVS Diodes; Stock: 14379; Pricing: 1=0.46, 10=0.302, 100=0.141, 500=0.134, 1000=0.127, 2000=0.1255, 5000=0.124 (USD); Mounting Technology: Surface Mount; Min Operating Temperature: -55°C; Max Operating Temperature: 150°C; Packaging: Cut Tape; Series: Automotive, AEC-Q101, AQ3045, SPA®; Number of Channels: 1; Operating Supply Voltage: 5.3V; RoHS Compliant: Yes; ComponentLink1URL: http://www.littelfuse.com/~/media/electronics/datasheets/tvs_diode_arrays/littelfuse_tvs_diode_array_aq3045_datasheet.pdf.pdf?src-supplier=Digikey; ComponentLink1Description: http://www.littelfuse.com/~/media/electronics/datasheets/tvs_diode_arrays/littelfuse_tvs_diode_array_aq3045_datasheet.pdf.pdf?src-supplier=Digikey; ComponentLink2URL: https://www.littelfuse.com/~/media/electronics/datasheets/tvs_diode_arrays/littelfuse_tvs_diode_array_aq3045_datasheet.pdf.pdf?src-supplier=Digikey; ComponentLink2Description: https://www.littelfuse.com/~/media/electronics/datasheets/tvs_diode_arrays/littelfuse_tvs_diode_array_aq3045_datasheet.pdf.pdf?src-supplier=Digikey; ComponentLink3URL: https://datasheet.octopart.com/AQ3045-01ETG-Littelfuse-datasheet-101609968.pdf?src-supplier=Farnell; ComponentLink3Description: https://datasheet.octopart.com/AQ3045-01ETG-Littelfuse-datasheet-101609968.pdf?src-supplier=Farnell; ComponentLink4URL: https://datasheet.octopart.com/AQ3045-01ETG-Littelfuse-datasheet-140480283.pdf?src-supplier=Future+Electronics; ComponentLink4Description: https://datasheet.octopart.com/AQ3045-01ETG-Littelfuse-datasheet-140480283.pdf?src-supplier=Future+Electronics; LCSC Part Number: C3710326
IC1 = ESP32-WROOM-32E-N8: Bluetooth, WiFi 802.11b/g/n, Bluetooth v4.2 +EDR, Class 1, 2 and 3 Transceiver Module 2.4GHz ~ 2.5GHz PCB Trace Surface Mount; MF: Espressif Systems; SnapEDA_Link: https://www.snapeda.com/parts/ESP32-WROOM-32E-N8/Espressif+Systems/view-part/?ref=snap; Package: SMD-44 Espressif Systems; Value: *; MP: ESP32-WROOM-32E-N8; Check_prices: https://www.snapeda.com/parts/ESP32-WROOM-32E-N8/Espressif+Systems/view-part/?ref=eda
IC2 = SST25PF040C-40I_MF: FLASH Memory IC 4Mb (512K x 8) SPI 40 MHz 8-WDFN (5x6); MF: Microchip; MP: SST25PF040C-40I/MF; SnapEDA_Link: https://www.snapeda.com/parts/SST25PF040C-40I/MF/Microchip+Technology/view-part/?ref=snap; Package: WDFN-8 Microchip; Value: *; Check_prices: https://www.snapeda.com/parts/SST25PF040C-40I/MF/Microchip+Technology/view-part/?ref=eda
J1 = TC2030-NL: Tag-Connect No-Solder SWD Debug Connector (No Legs) DO NOT PLACE; Manufacturer: Tag-Connect; Manufacturer Part Number: TC2030-NL-FP
J2 J3 = 217179-0001: CONN RCP USB2.0 TYP C 24P SMD RA; Manufacturer: Molex; Current Rating: 1.25A; Gender: Receptacle; Number of Contacts: 16; Voltage Rating: 30V; Supplier: Digikey; Supplier Part Number: 900-2171790001CT-ND; Manufacturer Part Number: 217179-0001; RoHS: No; Category: Connectors; Pricing: 1=0.79, 10=0.645, 25=0.5948, 50=0.5594, 100=0.5259, 250=0.48484, 500=0.45592, 1200=0.50175, 2400=0.4778, 3600=0.46433, 6000=0.4479, 8400=0.4374, 12000=0.42654 (USD); Contact Material: Nickel,Gold; Min Operating Temperature: -40°C; Max Operating Temperature: 85°C; USB Standard: USB 2.0; Height: 3.36mm; ComponentLink1Description: New link; ComponentLink1URL: *; LCSC Part Number: *
L1 = Inductor: Code_IEC: 1005; Published: 8-Jun-2000; LatestRevisionDate: 29-May-2009; LatestRevisionNote: IPC-7351 Footprint Added.; PackageReference: 0402-A; Publisher: Altium Limited; PackageDescription: Chip Inductor; Code_JEITA: 0402
P1 P2 = Header 10: Header, 10-Pin; LatestRevisionDate: 17-Jul-2002; LatestRevisionNote: Re-released for DXP Platform.; Publisher: Altium Limited
Q1 Q2 = SS8050-G: TRANS NPN 25V 1.5A SOT-23-3; Manufacturer: Comchip; Max Power Dissipation: 300mW; Transition Frequency: 100MHz; Collector-emitter Voltage-Max: 400mV; Collector Base Voltage (VCBO): 40V; Collector Emitter Saturation Voltage: 500mV; Emitter Base Voltage (VEBO): 5V; hFE Min: 200; Number of Elements: 1; Supplier: Digikey; Supplier Part Number: 641-1790-1-ND; Manufacturer Part Number: SS8050-G; RoHS: Yes; Category: Transistors; Stock: 153664; Pricing: 1=0.24, 10=0.148, 100=0.0921, 500=0.06754, 1000=0.05958 (USD); Mounting Technology: Surface Mount; Case/Package: TO-236-3; Max Operating Temperature: 150°C; Packaging: Cut Tape; Max Collector Current: 1.5A; Collector Emitter Breakdown Voltage: 25V; Max Breakdown Voltage: 25V; Series: -; Power Dissipation: 300mW; Height: 1.15mm; RoHS Compliant: Yes; ComponentLink1URL: http://www.comchiptech.com/admin/files/product/SS8050-G RevA181526.pdf?src-supplier=Digikey; ComponentLink1Description: http://www.comchiptech.com/admin/files/product/SS8050-G RevA181526.pdf?src-supplier=Digikey; LCSC Part Number: C164886
R1 = RC0402FR-07100KL: RES 10K OHM 1% 1/16W 0402; Manufacturer: Yageo; Additional Feature: LASER TRIMMABLE; Power: 62.5mW; Rated Temperature: 70°C; Value: 100kR; Working Voltage: 50V; Temperature Coefficient (ppm/Cel): 100; Package Height: 0.35mm; Package Length: 1mm; Package Width: 0.5mm; Supplier: Digikey; Supplier Part Number: 311-100KLRCT-ND; Manufacturer Part Number: RC0402FR-07100KL; RoHS: Yes; Category: Chip SMD Resistors; Stock: 5773614; Pricing: 1=0.1, 10=0.008, 100=0.0071, 1000=0.0051, 2500=0.00408 (USD); Mounting Technology: Surface Mount; Pins: 2; Package Shape: Rectangular; Case/Package: 0402; Terminal Finish: Nickel; Min Operating Temperature: -55°C; Max Operating Temperature: 155°C; Tolerance: 1%; JESD-609 Code: e3; Resistor Type: FIXED RESISTOR; Construction: Chip; Packaging: Tape and Reel; Technology: METAL GLAZE/THICK FILM; Termination: Wraparound; Reach SVHC Compliant: Yes; RoHS Compliant: Yes; ComponentLink1URL: https://datasheet.ciiva.com:443/pdfs/VipMasterIC/IC/YAGO/YAGO-S-A0008145938/YAGO-S-A0008145938-1.pdf?src-supplier=IHS+Markit; ComponentLink1Description: https://datasheet.ciiva.com:443/pdfs/VipMasterIC/IC/YAGO/YAGO-S-A0008145938/YAGO-S-A0008145938-1.pdf?src-supplier=IHS+Markit; ComponentLink2URL: http://www.farnell.com/datasheets/1836115.pdf?src-supplier=Farnell; ComponentLink2Description: http://www.farnell.com/datasheets/1836115.pdf?src-supplier=Farnell; ComponentLink3URL: http://www.farnell.com/datasheets/2167052.pdf?src-supplier=Farnell; ComponentLink3Description: http://www.farnell.com/datasheets/2167052.pdf?src-supplier=Farnell; ComponentLink4URL: http://www.farnell.com/datasheets/2167052.pdf?src-supplier=Element14; ComponentLink4Description: http://www.farnell.com/datasheets/2167052.pdf?src-supplier=Element14
R2 R3 R5-R9 R24-R26 = RC0402FR-071KL: RES 1K OHM 1% 1/16W 0402; Manufacturer: Yageo; Additional Feature: LASER TRIMMABLE; Power: 62.5mW; Rated Temperature: 70°C; Value: 1kR; Working Voltage: 50V; Temperature Coefficient (ppm/Cel): 100; Package Height: 0.35mm; Package Length: 1mm; Package Width: 0.5mm; Supplier: Digikey; Supplier Part Number: 311-1.00KLRCT-ND; Manufacturer Part Number: RC0402FR-071KL; RoHS: Yes; Category: Chip SMD Resistors; Stock: 1739365; Pricing: 1=0.1, 10=0.007, 100=0.0061, 1000=0.0051, 2500=0.00408 (USD); Mounting Technology: Surface Mount; Pins: 2; Package Shape: Rectangular; Case/Package: 0402; Terminal Finish: Nickel; Min Operating Temperature: -55°C; Max Operating Temperature: 155°C; Tolerance: 1%; JESD-609 Code: e3; Resistor Type: FIXED RESISTOR; Construction: Chip; Packaging: Tape and Reel; Technology: METAL GLAZE/THICK FILM; Termination: Wraparound; Reach SVHC Compliant: Yes; RoHS Compliant: Yes; ComponentLink1URL: https://datasheet.ciiva.com:443/pdfs/VipMasterIC/IC/YAGO/YAGO-S-A0008145938/YAGO-S-A0008145938-1.pdf?src-supplier=IHS+Markit; ComponentLink1Description: https://datasheet.ciiva.com:443/pdfs/VipMasterIC/IC/YAGO/YAGO-S-A0008145938/YAGO-S-A0008145938-1.pdf?src-supplier=IHS+Markit; ComponentLink2URL: https://datasheet.ciiva.com/11819/0900766b80c66297-11819477.pdf?src-supplier=Rs; ComponentLink2Description: https://datasheet.ciiva.com/11819/0900766b80c66297-11819477.pdf?src-supplier=Rs; ComponentLink3URL: https://datasheet.ciiva.com/7849/1018594-7849869.pdf?src-supplier=Element14; ComponentLink3Description: https://datasheet.ciiva.com/7849/1018594-7849869.pdf?src-supplier=Element14; ComponentLink4URL: https://datasheet.ciiva.com/7849/1018594-7849871.pdf?src-supplier=Element14; ComponentLink4Description: https://datasheet.ciiva.com/7849/1018594-7849871.pdf?src-supplier=Element14; ComponentLink5URL: https://datasheet.ciiva.com/7983/1018594-7983502.pdf?src-supplier=Element14; ComponentLink5Description: https://datasheet.ciiva.com/7983/1018594-7983502.pdf?src-supplier=Element14; ComponentLink6URL: https://datasheet.ciiva.com/22747/1018594-22747513.pdf?src-supplier=Element14; ComponentLink6Description: https://datasheet.ciiva.com/22747/1018594-22747513.pdf?src-supplier=Element14; ComponentLink7URL: https://datasheet.ciiva.com/17063/pyu-rc0402-51-rohs-l-6-r-17063193.pdf?src-supplier=Future+Electronics; ComponentLink7Description: https://datasheet.ciiva.com/17063/pyu-rc0402-51-rohs-l-6-r-17063193.pdf?src-supplier=Future+Electronics; ComponentLink8URL: https://datasheet.ciiva.com/12666/pyu-rc0402-51-rohs-l-6-r-12666741.pdf?src-supplier=Mouser; ComponentLink8Description: https://datasheet.ciiva.com/12666/pyu-rc0402-51-rohs-l-6-r-12666741.pdf?src-supplier=Mouser; LCSC Part Number: C106235
R4 R19 = RC0402FR-074K7L: RES 4.7K OHM 1% 1/16W 0402; Manufacturer: Yageo; Voltage Rating (DC): 50V; Power Rating: 62.5mW; Value: 4.7kR; Temperature Coefficient: 100ppm/°C; Max Power Dissipation: 63mW; Supplier: Digikey; Supplier Part Number: 311-4.7KLRCT-ND; Manufacturer Part Number: RC0402FR-074K7L; RoHS: Yes; Category: Chip SMD Resistors; Stock: 3421904; Pricing: 1=0.1, 10=0.007, 100=0.0061, 1000=0.0051, 2500=0.00408 (USD); Case/Package: 0402; Pins: 2; Case Code (Imperial): 0402; Case Code (Metric): 1005; Min Operating Temperature: -55°C; Max Operating Temperature: 155°C; Tolerance: 1%; Voltage Rating: 50V; Packaging: Tape and Reel; Resistor Type: Thick Film; Termination: SMD/SMT; Features: Moisture Resistant; Series: RC; Number of Terminations: 2; Resistance Tolerance: 1%; Construction: Rectangular; Voltage Rating (AC): 50V; Length: 1mm; Width: 0.5mm; Depth: 0.5mm; Reach SVHC Compliant: No; Military Standard: Not; Lead Free: Lead Free; RoHS Compliant: Yes; ComponentLink1URL: https://datasheet.ciiva.com/7850/1018594-7850022.pdf?src-supplier=Element14; ComponentLink1Description: https://datasheet.ciiva.com/7850/1018594-7850022.pdf?src-supplier=Element14; ComponentLink2URL: https://datasheet.ciiva.com/7850/1018594-7850023.pdf?src-supplier=Element14; ComponentLink2Description: https://datasheet.ciiva.com/7850/1018594-7850023.pdf?src-supplier=Element14; ComponentLink3URL: https://datasheet.ciiva.com/22661/1686128-22661342.pdf?src-supplier=Element14; ComponentLink3Description: https://datasheet.ciiva.com/22661/1686128-22661342.pdf?src-supplier=Element14; LCSC Part Number: C105871
R10 R12 R20 R21 = RC0402FR-075K1L: RES 5.1K OHM 1% 1/16W 0402; Manufacturer: Yageo; Power Rating: 63mW; Voltage Rating: 50V; Value: 5.1kR; Temperature Coefficient: 100ppm/°C; Supplier: Digikey; Supplier Part Number: 311-5.10KLRCT-ND; Manufacturer Part Number: RC0402FR-075K1L; RoHS: Yes; Category: Chip SMD Resistors; Stock: 129816; Pricing: 1=0.1, 10=0.008, 100=0.0066, 1000=0.0051, 2500=0.00459, 5000=0.00408, 10000=0.00204, 20000=0.00179, 30000=0.0016, 50000=0.00149, 70000=0.00139 (USD); Case/Package: 0402; Case Code (Metric): 1005; Case Code (Imperial): 0402; Min Operating Temperature: -55°C; Max Operating Temperature: 155°C; Tolerance: 1%; Packaging: Tape and Reel; Package Quantity: 1; Resistor Type: Thick Film; Number of Terminations: 2; Termination: SMD/SMT; Max Power Dissipation: 63mW; Voltage Rating (DC): 50V; Features: Moisture Resistant; Series: RC; Resistance Tolerance: 1%; Technology: THICK FILM; Working Voltage: 50V; Construction: Rectangular; Length: 1mm; Width: 0.02inch; Height: 0.016inch; Depth: 0.5mm; Lead Free: Lead Free; RoHS Compliant: Yes; Reach SVHC Compliant: Unknown; Military Standard: Not; LCSC Part Number: C105872
R11 R22 R23 R28 R29 = AC0402FR-0710KL: RES SMD 10K OHM 1% 1/16W 0402; Manufacturer: Yageo; Additional Feature: LASER TRIMMABLE; Power: 62.5mW; Rated Temperature: 70°C; Value: 10kR; Working Voltage: 50V; Temperature Coefficient (ppm/Cel): 100; Package Height: 0.32mm; Package Length: 1mm; Package Width: 0.5mm; Reference Standard: AEC-Q200; Supplier: Digikey; Supplier Part Number: YAG3436CT-ND; Manufacturer Part Number: AC0402FR-0710KL; RoHS: Yes; Category: Chip SMD Resistors; Stock: 489290; Pricing: 1=0.1, 10=0.009, 100=0.0082, 1000=0.00714, 2500=0.00612, 5000=0.0051 (USD); Mounting Technology: Surface Mount; Pins: 2; Package Shape: Rectangular; Case/Package: 0402; Terminal Finish: Nickel; Min Operating Temperature: -55°C; Max Operating Temperature: 155°C; Tolerance: 1%; JESD-609 Code: e3; Resistor Type: FIXED RESISTOR; Construction: Chip; Packaging: Tape and Reel; Technology: METAL GLAZE/THICK FILM; Termination: Wraparound; Reach SVHC Compliant: Yes; RoHS Compliant: Yes; ComponentLink1URL: https://datasheet.ciiva.com:443/pdfs/VipMasterIC/IC/YAGO/YAGO-S-A0003597364/YAGO-S-A0003597364-1.pdf?src-supplier=IHS+Markit; ComponentLink1Description: https://datasheet.ciiva.com:443/pdfs/VipMasterIC/IC/YAGO/YAGO-S-A0003597364/YAGO-S-A0003597364-1.pdf?src-supplier=IHS+Markit; ComponentLink2URL: https://datasheet.ciiva.com/12656/pyu-ac-51-rohs-l-2-12656634.pdf?src-supplier=Mouser; ComponentLink2Description: https://datasheet.ciiva.com/12656/pyu-ac-51-rohs-l-2-12656634.pdf?src-supplier=Mouser; LCSC Part Number: C144807
R13-R15 R18 = RC0402JR-070RL: RES 0 OHM JUMPER 1/16W 0402; Manufacturer: Yageo; Value: 0mR; Power Rating: 62.5mW; Tolerance: 5%; Voltage Rating: 50V; Max Power Dissipation: 63mW; Temperature Coefficient: 200ppm/°C; Supplier: Digikey; Supplier Part Number: 311-0.0JRCT-ND; Manufacturer Part Number: RC0402JR-070RL; RoHS: Yes; Category: Chip SMD Resistors; Stock: 11398691; Pricing: 1=0.1, 10=0.003, 25=0.0024 (USD); Case/Package: 0402; Case Code (Metric): 1005; Case Code (Imperial): 0402; Contact Plating: Tin,Matte; Min Operating Temperature: -55°C; Max Operating Temperature: 155°C; Series: RC; Package Quantity: 1; Packaging: Tape and Reel; Resistor Type: Thick Film; Number of Terminations: 2; Termination: SMD/SMT; Features: Moisture Resistant; Technology: THICK FILM; Resistance Tolerance: 5%; Construction: Rectangular; Length: 1mm; Width: 0.02inch; Height: 0.016inch; Depth: 0.5mm; Military Standard: Not; Lead Free: Lead Free; RoHS Compliant: Yes; Reach SVHC Compliant: Unknown; ComponentLink1URL: https://datasheet.ciiva.com/2452/pyu-rc0402-51-rohs-l-6-2452608.pdf?src-supplier=Digikey; ComponentLink1Description: https://datasheet.ciiva.com/2452/pyu-rc0402-51-rohs-l-6-2452608.pdf?src-supplier=Digikey; ComponentLink2URL: https://datasheet.ciiva.com/11808/0900766b80c66297-11808195.pdf?src-supplier=Rs; ComponentLink2Description: https://datasheet.ciiva.com/11808/0900766b80c66297-11808195.pdf?src-supplier=Rs; ComponentLink3URL: https://datasheet.ciiva.com/2452/pyu-r-int-thick-7-2452609.pdf?src-supplier=Digikey; ComponentLink3Description: https://datasheet.ciiva.com/2452/pyu-r-int-thick-7-2452609.pdf?src-supplier=Digikey; ComponentLink4URL: https://datasheet.ciiva.com/2452/pyu-r-int-thick-7-2452610.pdf?src-supplier=Digikey; ComponentLink4Description: https://datasheet.ciiva.com/2452/pyu-r-int-thick-7-2452610.pdf?src-supplier=Digikey; ComponentLink5URL: https://datasheet.ciiva.com/8896/pyu-rc0402-51-rohs-l-6-8896201.pdf?src-supplier=Avnet; ComponentLink5Description: https://datasheet.ciiva.com/8896/pyu-rc0402-51-rohs-l-6-8896201.pdf?src-supplier=Avnet; ComponentLink6URL: https://datasheet.ciiva.com/15189/getdatasheetpartid-326379-15189533.pdf?src-supplier=Verical; ComponentLink6Description: https://datasheet.ciiva.com/15189/getdatasheetpartid-326379-15189533.pdf?src-supplier=Verical; ComponentLink7URL: https://datasheet.ciiva.com/7983/1018594-7983535.pdf?src-supplier=Element14; ComponentLink7Description: https://datasheet.ciiva.com/7983/1018594-7983535.pdf?src-supplier=Element14; ComponentLink8URL: https://datasheet.ciiva.com/22747/1018594-22747515.pdf?src-supplier=Element14; ComponentLink8Description: https://datasheet.ciiva.com/22747/1018594-22747515.pdf?src-supplier=Element14; LCSC Part Number: C60485
R16 R17 R27 = RC0402FR-0727RL: RES 27 OHM 1% 1/16W 0402; Manufacturer: Yageo; Additional Feature: LASER TRIMMABLE; Power: 62.5mW; Rated Temperature: 70°C; Value: 27R; Working Voltage: 50V; Temperature Coefficient (ppm/Cel): 100; Package Height: 0.35mm; Package Length: 1mm; Package Width: 0.5mm; Supplier: Digikey; Supplier Part Number: YAG3086CT-ND; Manufacturer Part Number: RC0402FR-0727RL; RoHS: Yes; Category: Chip SMD Resistors; Stock: 416445; Pricing: 1=0.1, 10=0.007, 100=0.0056, 1000=0.00408, 2500=0.00357 (USD); Mounting Technology: Surface Mount; Pins: 2; Package Shape: Rectangular; Case/Package: 0402; Terminal Finish: Nickel; Min Operating Temperature: -55°C; Max Operating Temperature: 155°C; Tolerance: 1%; JESD-609 Code: e3; Resistor Type: FIXED RESISTOR; Construction: Chip; Packaging: Tape and Reel; Technology: METAL GLAZE/THICK FILM; Termination: Wraparound; Reach SVHC Compliant: Yes; RoHS Compliant: Yes; ComponentLink1URL: https://datasheet.ciiva.com:443/pdfs/VipMasterIC/IC/YAGO/YAGO-S-A0008145938/YAGO-S-A0008145938-1.pdf?src-supplier=IHS+Markit; ComponentLink1Description: https://datasheet.ciiva.com:443/pdfs/VipMasterIC/IC/YAGO/YAGO-S-A0008145938/YAGO-S-A0008145938-1.pdf?src-supplier=IHS+Markit; ComponentLink2URL: https://datasheet.ciiva.com/11808/0900766b80c66297-11808450.pdf?src-supplier=Rs; ComponentLink2Description: https://datasheet.ciiva.com/11808/0900766b80c66297-11808450.pdf?src-supplier=Rs; ComponentLink3URL: https://datasheet.ciiva.com/7849/1018594-7849927.pdf?src-supplier=Element14; ComponentLink3Description: https://datasheet.ciiva.com/7849/1018594-7849927.pdf?src-supplier=Element14; ComponentLink4URL: https://datasheet.ciiva.com/7849/1018594-7849926.pdf?src-supplier=Element14; ComponentLink4Description: https://datasheet.ciiva.com/7849/1018594-7849926.pdf?src-supplier=Element14; LCSC Part Number: C138021
S1 = SW-SPDT: SPDT Subminiature Toggle Switch, Right Angle Mounting, Vertical Actuation; Published: 24-Mar-1999; LatestRevisionDate: 17-Dec-2003; LatestRevisionNote: Schematic revised, PCB Footprint replaced.; DatasheetVersion: 05-Dec-2000; PackageReference: TL36WW15050; Publisher: Altium Limited; PackageDescription: Switch; 4 Leads; ComponentLink1Description: Manufacturer Link; ComponentLink1URL: http://www.apem.com
SW1 SW2 = PTS645SH50SMTR92LFS: SWITCH TACTILE SPST-NO 0.05A 12V; Manufacturer: ITT C&K; Manufacturer Series: PTS645; Actuator Type: Pushbutton; Contact Current(DC)-Max: 50mA; Contact DC Max Rating R Load: 0.05A@12VDC; Contact Resistance: 0.1mR; Dielectric Withstand Volts: 250VACV; Insulation Resistance: 100GR; PCB Hole Count: 4; Switch Action: MOMENTARY; Switch Function: SPST; Switch Type: Keypad; Body Breadth: 5.9944mm; Body Height: 3.4544mm; Supplier: Digikey; Supplier Part Number: CKN9085CT-ND; Manufacturer Part Number: PTS645SH50SMTR92LFS; RoHS: Yes; Category: Tactile Switches; Stock: 20276; Pricing: 1=0.4, 10=0.325, 25=0.2992, 100=0.2639, 250=0.24264, 500=0.22758 (USD); Mounting Technology: Surface Mount; Terminal Finish: Silver; Min Operating Temperature: -20°C; Max Operating Temperature: 60°C; JESD-609 Code: e4; Contact Voltage(DC)-Max: 12V; Termination: Solder; Body Length or Diameter: 5.9944mm; Terminal Length: 0.138inch; Reach SVHC Compliant: Yes; RoHS Compliant: Yes; ComponentLink1URL: https://datasheet.ciiva.com:443/pdfs/VipMasterIC/IC/CKCI/CKCI-S-A0001796527/CKCI-S-A0001796842-1.pdf?src-supplier=IHS+Markit; ComponentLink1Description: https://datasheet.ciiva.com:443/pdfs/VipMasterIC/IC/CKCI/CKCI-S-A0001796527/CKCI-S-A0001796842-1.pdf?src-supplier=IHS+Markit; ComponentLink2URL: https://datasheet.ciiva.com/29903/getdatasheetpartid-773702-29903807.pdf?src-supplier=Verical; ComponentLink2Description: https://datasheet.ciiva.com/29903/getdatasheetpartid-773702-29903807.pdf?src-supplier=Verical; ComponentLink3URL: https://datasheet.ciiva.com/14920/pts645-14920741.pdf?src-supplier=Digikey; ComponentLink3Description: https://datasheet.ciiva.com/14920/pts645-14920741.pdf?src-supplier=Digikey; ComponentLink4URL: https://datasheet.ciiva.com/22637/1707731-22637356.pdf?src-supplier=Element14; ComponentLink4Description: https://datasheet.ciiva.com/22637/1707731-22637356.pdf?src-supplier=Element14; TCSC Part Number: *
X1 = TSX-322524.0000MF15X-AC0: 24 MHz +/-10ppm Crystal 9pF 40 Ohms 4-SMD, No Lead; Manufacturer_Name: Miyazaki Epson Corporation; Geometry.Height: 0.6mm; Manufacturer_Part_Number: TSX-322524.0000MF15X-AC0; Mouser Part Number: *; Mouser Price/Stock: *; Arrow Part Number: *; Arrow Price/Stock: *; Datasheet Link: https://support.epson.biz/td/api/doc_check.php?dl=brief_TSX-3225&lang=en
Y1 = XTAL: Crystal Oscillator; Published: 8-Jun-2000; LatestRevisionDate: 17-Jul-2002; LatestRevisionNote: Re-released for DXP Platform.; PackageReference: R38; Publisher: Altium Limited; PackageDescription: Crystal, Thru-Hole; 2 Leads; Body 3.1 x 8.2 mm (Dia.xH)